# EAGLE design Board (EAGLE 6.5.0)
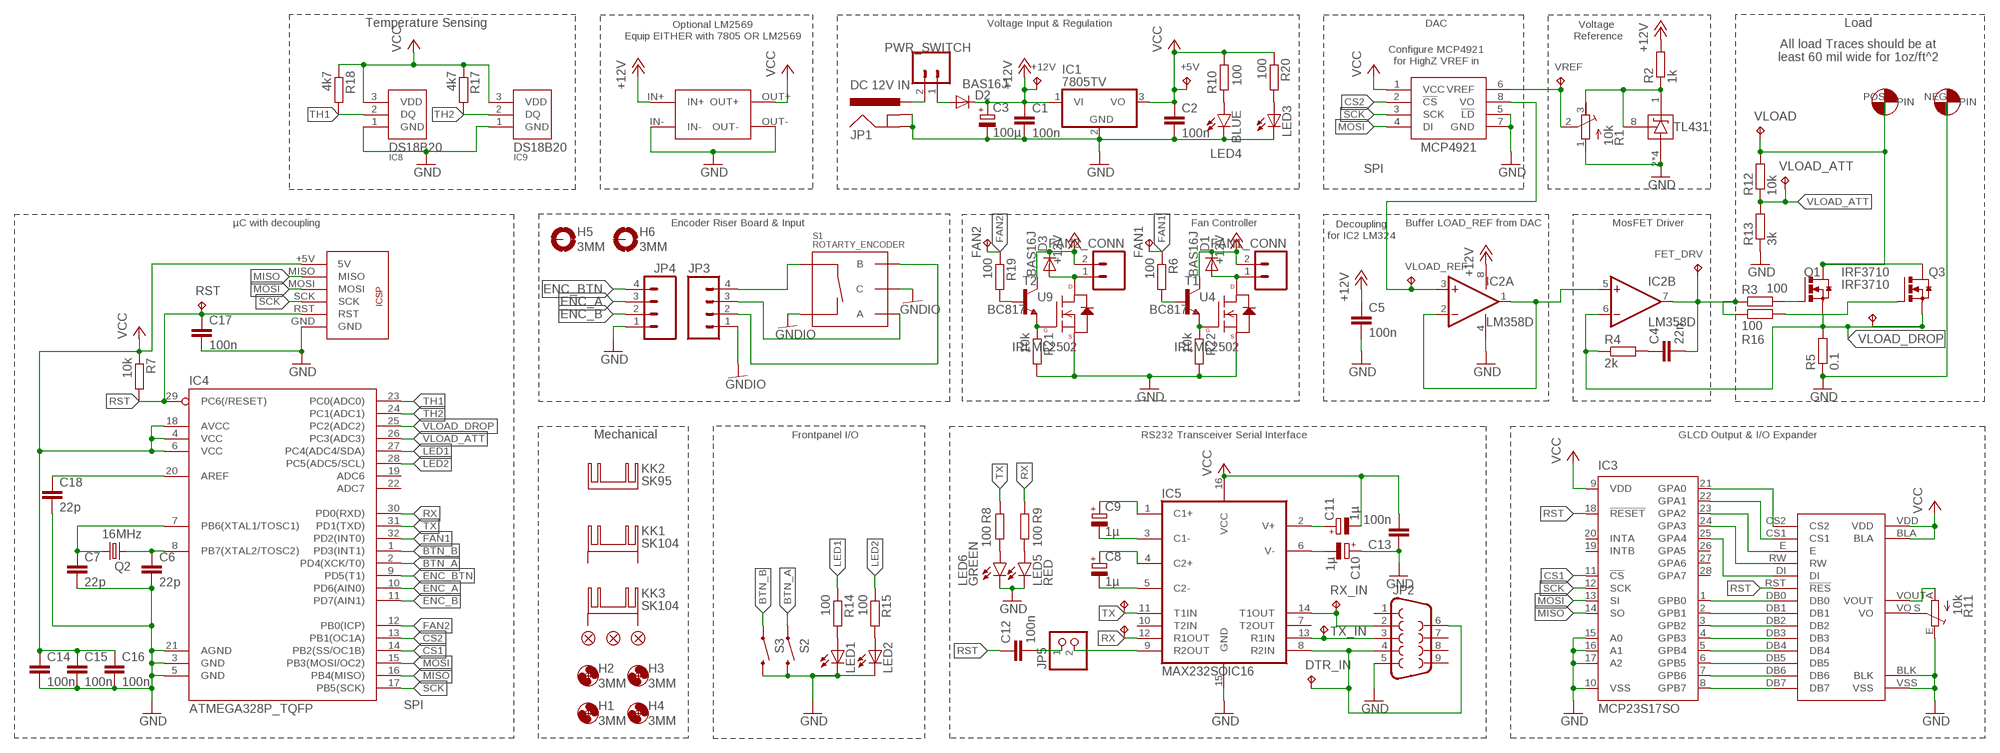
[diagram p0: schematic, sheet 1]

## Parts
+5V  TPB1,27  [B1,27]
+12V  TPB1,27  [B1,27]
C1  100n  C-EUC1206K  [C1206K]
C2  100n  C-EUC1206K  [C1206K]
C3  100µ  CPOL-EU175TMP-0808  [175TMP-0808]
C4  22n  C-EUC1206  [C1206]
C5  100n  C-EUC1206K  [C1206K]
C6  22p  C-EUC1206K  [C1206K]
C7  22p  C-EUC1206K  [C1206K]
C8  1µ  CPOL-EU153CLV-0405  [153CLV-0405]
C9  1µ  CPOL-EU153CLV-0405  [153CLV-0405]
C10  1µ  CPOL-EU153CLV-0405  [153CLV-0405]
C11  1µ  CPOL-EU153CLV-0405  [153CLV-0405]
C12  100n  C-EUC1206K  [C1206K]
C13  100n  C-EUC1206K  [C1206K]
C14  100n  C-EUC1206K  [C1206K]
C15  100n  C-EUC1206K  [C1206K]
C16  100n  C-EUC1206K  [C1206K]
C17  100n  C-EUC1206K  [C1206K]
C18  22p  C-EUC1206K  [C1206K]
D1  BAS16J  DIODE-SOD323-W  [SOD323-W]
D2  BAS16J  DIODE-SOD323-W  [SOD323-W]
D3  BAS16J  DIODE-SOD323-W  [SOD323-W]
DTR_IN  TPB1,27  [B1,27]
FAN1  TPB1,27  [B1,27]
FAN1_CONN  M02POLAR  [MOLEX-1X2]
FAN2  TPB1,27  [B1,27]
FAN2_CONN  M02POLAR  [MOLEX-1X2]
FET_DRV  TPB1,27  [B1,27]
FID1  FIDUCIAL1X2  [FIDUCIAL-1X2]
FID2  FIDUCIAL1X2  [FIDUCIAL-1X2]
FID3  FIDUCIAL1X2  [FIDUCIAL-1X2]
H1  3MM  MOUNT-HOLE3.0  [3,0]
H2  3MM  MOUNT-HOLE3.0  [3,0]
H3  3MM  MOUNT-HOLE3.0  [3,0]
H4  3MM  MOUNT-HOLE3.0  [3,0]
H5  3MM  MOUNT-PAD-ROUND3.0  [3,0-PAD]
H6  3MM  MOUNT-PAD-ROUND3.0  [3,0-PAD]
IC1  7805TV  [TO220V]
IC2  LM358D  [SO08]
IC3  MCP23S17SO  [SO28W]
IC4  ATMEGA328P_TQFP  [TQFP32-08]
IC5  MAX232SOIC16  [SO016]
IC6  MCP4921  [SO-8]
IC7  TL431CD  [SO-8]
IC8  DS18B20  [TO-92]
IC9  DS18B20  [TO-92]
JP1  DC 12V IN  POWER_JACKPTH  [POWER_JACK_PTH]
JP2  DB9FEMALE  [DB9]
JP3  M04POLAR  [MOLEX-1X4]
JP4  M04POLAR  [MOLEX-1X4]
JP5  PINHD-1X2  [1X02]
KK1  SK104  SK104-PAD  [SK104-PAD]
KK2  SK95  SK95-2M3  [SK95-2M3]
KK3  SK104  SK104-PAD  [SK104-PAD]
LED1  LEDB155  [Q62902-B155]
LED2  LEDB155  [Q62902-B155]
LED3  LEDB155  [Q62902-B155]
LED4  BLUE  LED0603  [LED-0603]
LED5  RED  LED0603  [LED-0603]
LED6  GREEN  LED0603  [LED-0603]
PWR_SWITCH  M02POLAR  [MOLEX-1X2]
Q1  IRF3710  IRFZ44N  [TO-220-V]
Q2  16MHz  CRYSTALHC49UP  [HC49UP]
Q3  IRF3710  IRFZ44N  [TO-220-V]
R1  10k  R-TRIMM3296Y  [RTRIM3296Y]
R2  1k  R-EU_M1206  [M1206]
R3  100  R-EU_R1206  [R1206]
R4  2k  R-EU_R1206  [R1206]
R5  0.1  R-EU_VTA52  [VTA52]
R6  100  R-EU_R1206  [R1206]
R7  10k  R-EU_R1206  [R1206]
R8  100  R-EU_R1206  [R1206]
R9  100  R-EU_R1206  [R1206]
R10  100  R-EU_R1206  [R1206]
R11  10k  TRIM_EU-RS3  [RS3]
R12  10k  R-EU_R1206  [R1206]
R13  3k  R-EU_R1206  [R1206]
R14  100  R-EU_R1206  [R1206]
R15  100  R-EU_R1206  [R1206]
R16  100  R-EU_R1206  [R1206]
R17  4k7  R-EU_M1206  [M1206]
R18  4k7  R-EU_M1206  [M1206]
R19  100  R-EU_R1206  [R1206]
R20  100  R-EU_R1206  [R1206]
R21  10k  R-EU_R1206  [R1206]
R22  10k  R-EU_R1206  [R1206]
RST  TPB1,27  [B1,27]
RX  TPB1,27  [B1,27]
RX_IN  TPB1,27  [B1,27]
S1  ROTARTY_ENCODER  [ROTARY_ENC_PLAIN]
S2  SWITCH-MOMENTARY-2SIDE_EZ  [TACTILE-PTH-SIDEEZ]
S3  SWITCH-MOMENTARY-2SIDE_EZ  [TACTILE-PTH-SIDEEZ]
T1  BC817  BC817-NPN-SOT23-BEC  [SOT23-BEC]
T2  BC817  BC817-NPN-SOT23-BEC  [SOT23-BEC]
TX  TPB1,27  [B1,27]
TX_IN  TPB1,27  [B1,27]
U4  IRLML2502  N-CHANNEL-MOSFET-BSS138  [SOT23-3]
U9  IRLML2502  N-CHANNEL-MOSFET-BSS138  [SOT23-3]
U$3  CON-2-HIGAMP  [CON-HIGHAMP-0.3"]
U$5  ICSPTHROUGHHOLE  [ICSP-THROUGHHOLE]
U$6  KS0108-GLCDS6B0108  [KS0108-S6B0108-GLCD]
U$10  LM2569NO_OUTLINE  [LM2596_NO_OUTLINE]
VLOAD  TPB1,27  [B1,27]
VLOAD_ATT  TPB1,27  [B1,27]
VLOAD_DROP  TPB1,27  [B1,27]
VLOAD_REF  TPB1,27  [B1,27]
VREF  TPB1,27  [B1,27]

## Nets
+12V: +12V.TP C1.1 C3.+ C5.1 D1.C D2.C D3.C FAN1_CONN.2 FAN2_CONN.2 IC1.1(VI) IC2.8(P:V+) R2.2 T1.C T2.C U$10.IN+
BTN_A: IC4.2(PD4(XCK/T0)) S2.1
BTN_B: IC4.1(PD3(INT1)) S3.1
CS1: IC3.11(!CS) IC4.14(PB2(SS/OC1B))
CS2: IC4.13(PB1(OC1A)) IC6.2(!CS!)
ENC_A: IC4.10(PD6(AIN0)) JP4.3
ENC_B: IC4.11(PD7(AIN1)) JP4.2
ENC_BTN: IC4.9(PD5(T1)) JP4.4
FAN1: FAN1.TP IC4.32(PD2(INT0)) R6.1
FAN2: FAN2.TP IC4.12(PB0(ICP)) R19.1
GND: C1.2 C2.2 C3.- C5.2 C6.2 C7.2 C10.+ C13.1 C14.2 C15.2 C16.2 C17.2 C18.2 IC1.2(GND) IC2.4(P:V-) IC3.10(VSS) IC3.15(A0) IC3.16(A1) IC3.17(A2) IC4.3(GND) IC4.5(GND) IC4.21(AGND) IC5.15(GND) IC6.5(!LD!) IC6.7(GND) IC7.2(ANODE) IC7.3(ANODE) IC7.6(ANODE) IC7.7(ANODE) IC8.1(GND) IC9.1(GND) JP1.GND JP1.GNDBREAK JP2.5 JP4.1 LED1.K(C) LED2.K(C) LED3.K(C) LED4.C LED5.C LED6.C R1.1(A) R5.1 R11.E R13.1 R21.2 R22.2 S2.2 S3.2 U4.2(S) U9.2(S) U$3.NEG U$5.GND U$6.BLK U$6.VSS U$10.IN- U$10.OUT-
GNDIO: JP3.1 S1.C S1.SW-
LED1: IC4.27(PC4(ADC4/SDA)) R14.1
LED2: IC4.28(PC5(ADC5/SCL)) R15.1
LOAD+: Q1.2(D) Q3.2(D) R12.2 U$3.POS VLOAD.TP
MISO: IC3.14(SO) IC4.16(PB4(MISO)) U$5.MISO
MOSI: IC3.13(SI) IC4.15(PB3(MOSI/OC2)) IC6.4(DI) U$5.MOSI
N$1: IC7.1(CATHODE) IC7.8(REF) R1.3(E) R2.1
N$2: IC6.6(VREF) R1.2(S) VREF.TP
N$3: C4.1 R4.2
N$4: R22.1 T1.E U4.1(G)
N$5: D1.A FAN1_CONN.1 U4.3(D)
N$6: Q1.1(G) R3.2
N$7: IC5.9(R2OUT) JP5.2
N$8: R6.2 T1.B
N$9: C7.1 IC4.7(PB6(XTAL1/TOSC1)) Q2.1
N$10: C4.2 FET_DRV.TP IC2.7(B:OUT) R3.1 R16.1
N$11: C6.1 IC4.8(PB7(XTAL2/TOSC2)) Q2.2
N$12: DTR_IN.TP IC5.8(R2IN) JP2.4 JP2.6
N$13: IC5.14(T1OUT) JP2.2 RX_IN.TP
N$14: IC5.13(R1IN) JP2.3 TX_IN.TP
N$15: C9.- IC5.3(C1-)
N$16: C9.+ IC5.1(C1+)
N$17: C8.- IC5.5(C2-)
N$18: C8.+ IC5.4(C2+)
N$19: C11.+ IC5.2(V+)
N$20: LED4.A R10.2
N$21: C10.- IC5.6(V-)
N$22: LED6.A R8.2
N$23: LED5.A R9.2
N$24: R11.S U$6.VO
N$25: R11.A U$6.VOUT
N$26: JP1.PWR PWR_SWITCH.2
N$27: IC3.1(GPB0) U$6.DB0
N$28: IC3.2(GPB1) U$6.DB1
N$29: IC3.3(GPB2) U$6.DB2
N$30: IC3.4(GPB3) U$6.DB3
N$31: IC3.5(GPB4) U$6.DB4
N$32: IC3.6(GPB5) U$6.DB5
N$33: IC3.7(GPB6) U$6.DB6
N$34: IC3.8(GPB7) U$6.DB7
N$35: IC3.21(GPA0) U$6.CS2
N$36: IC3.22(GPA1) U$6.CS1
N$37: IC3.23(GPA2) U$6.E
N$38: IC3.24(GPA3) U$6.RW
N$39: IC3.25(GPA4) U$6.DI
N$40: C18.1 IC4.20(AREF)
N$41: D2.A PWR_SWITCH.1
N$42: R21.1 T2.E U9.1(G)
N$43: LED1.A R14.2
N$44: LED2.A R15.2
N$45: JP3.4 S1.SW+
N$46: JP3.3 S1.A
N$47: Q3.1(G) R16.2
N$48: R19.2 T2.B
N$49: JP3.2 S1.B
N$50: D3.A FAN2_CONN.1 U9.3(D)
N$51: LED3.A R20.2
RST: C12.1 C17.1 IC3.18(!RESET) IC4.29(PC6(/RESET)) R7.2 RST.TP U$5.RST U$6.RST(!RES!)
RST_EN: C12.2 JP5.1
RX: IC4.30(PD0(RXD)) IC5.12(R1OUT) R9.1 RX.TP
SCK: IC3.12(SCK) IC4.17(PB5(SCK)) IC6.3(SCK) U$5.SCK
TH1: IC4.23(PC0(ADC0)) IC8.2(DQ) R18.2
TH2: IC4.24(PC1(ADC1)) IC9.2(DQ) R17.2
TX: IC4.31(PD1(TXD)) IC5.11(T1IN) R8.1 TX.TP
VCC: +5V.TP C2.1 C11.- C13.2 C14.1 C15.1 C16.1 IC1.3(VO) IC3.9(VDD) IC4.4(VCC) IC4.6(VCC) IC4.18(AVCC) IC5.16(VCC) IC6.1(VCC) IC8.3(VDD) IC9.3(VDD) R7.1 R10.1 R17.1 R18.1 R20.1 U$5.+5V(5V) U$6.BLA U$6.VDD U$10.OUT+
VLOAD_ATT: IC4.26(PC3(ADC3)) R12.1 R13.2 VLOAD_ATT.TP
VLOAD_DROP: IC2.6(B:-IN) IC4.25(PC2(ADC2)) Q1.3(S) Q3.3(S) R4.1 R5.2 VLOAD_DROP.TP
VLOAD_REF: IC2.3(A:+IN) IC6.8(VO) VLOAD_REF.TP
VREF_BUF: IC2.1(A:OUT) IC2.2(A:-IN) IC2.5(B:+IN)
Unconnected: H5.B3,0(MOUNT) H6.B3,0(MOUNT) IC3.19(INTB) IC3.20(INTA) IC3.26(GPA5) IC3.27(GPA6) IC3.28(GPA7) IC4.19(ADC6) IC4.22(ADC7) IC5.7(T2OUT) IC5.10(T2IN) JP2.1 JP2.7 JP2.8 JP2.9 KK1.K1(K) KK1.K2(K) KK3.K1(K) KK3.K2(K)

## Notes on the sheet
- Temperature Sensing | Voltage Input & Regulation | DAC | Load
- Optional LM2569
  Equip EITHER with 7805 OR LM2569
- Voltage 
  Reference
- All load Traces should be at 
  least 60 mil wide for 1oz/ft^2
- Configure MCP4921
  for HighZ VREF in
- SPI
- µC with decoupling | Encoder Riser Board & Input | Fan Controller | Buffer LOAD_REF from DAC | MosFET Driver
- Decoupling
  for IC2 LM324
- Mechanical | Frontpanel I/O | RS232 Transceiver Serial Interface | GLCD Output & I/O Expander
- SPI

## Library data of the parts
+5V +12V DTR_IN FAN1 FAN2 FET_DRV RST RX RX_IN TX TX_IN VLOAD VLOAD_ATT VLOAD_DROP VLOAD_REF VREF = testpad:TP: Test pad
C1 C2 C4-C7 C12-C18 = rcl:C-EU: CAPACITOR, European symbol
C3 C8-C11 = rcl:CPOL-EU: POLARIZED CAPACITOR, European symbol
D1-D3 = diode:DIODE-: DIODE
FAN1_CONN FAN2_CONN PWR_SWITCH = SparkFun-Connectors:M02: Standard 2-pin 0.1" header. Use with - straight break away headers ( PRT-00116) - right angle break away headers (PRT-00553) - swiss pins (PRT-00743) - machine pins (PRT-00117) - female headers (PRT-00115) Molex polarized connector foot print use with: PRT-08233 with associated crimp pins and housings. 2.54_SCREWTERM for use with PRT-10571. 3.5mm Screw Terminal footprints for PRT-08084 5mm Screw Terminal footprints for use with PRT-08432
FID1-FID3 = SparkFun-Aesthetics:FIDUCIAL: Fiducial Alignment Points Various fiducial points for machine vision alignment.
H1-H4 = holes:MOUNT-HOLE: MOUNTING HOLE with drill center marker
H5 H6 = holes:MOUNT-PAD-ROUND: MOUNTING PAD, round
IC1 = linear:78*: Positive VOLTAGE REGULATOR Source: http://cache.national.com/ds/LM/LM78L05.pdf http://www.fairchildsemi.com/ds/LM/LM7805.pdf
IC2 = linear:LM358: OP AMP also LM158; LM258; LM2904 Source: http://cache.national.com/ds/LM/LM158.pdf
IC3 = microchip:MCP23S17: http://ww1.microchip.com/downloads/en/DeviceDoc/21952a.pdf Source: http://ww1.microchip.com/downloads/en/DeviceDoc/21952a.pdf; MF: MICROCHIP; MPN: MCP23S17-E/SO; OC_FARNELL: unknown; OC_NEWARK: 31K2950
IC4 = SparkFun-DigitalIC:ATMEGA328P_TQFP; PROD_ID: IC-09069
IC5 = SparkFun-DigitalIC:MAX232: RS232 Transceiver Very common IC. This is generically called 'MAX232', but works with the 3V equivalent MAX3232 generic ICs. Field tested and mother approved. Spark Fun Electronics SKU : COM-00316 (DIP) and COM-00589 (SMD); PROD_ID: IC-08171
IC6 = OwnStuff:MCP4921
IC7 = OwnStuff:TL431
IC8 IC9 = OwnStuff:DS18B20
JP1 = SparkFun-Connectors:POWER_JACK: Power Jack This is the standard 5.5mm barrel jack for power. The PTH is the most common, proven, reliable, footprint. The Slot footprint only works if the mill layer is transmitted to the PCB fab house so be warned. Mating wall wart : TOL-00298 (and others); PROD_ID: CONN-08197
JP2 = SparkFun-Connectors:DB9: DB9 Connector Standard DB9 (D-Sub 9) serial connector. Can be used for CAN bus as well as RS485 and RS232. Footprint production proven. Spark Fun Electronics SKU : PRT-00429; PROD_ID: CONN-08194
JP3 JP4 = SparkFun-Connectors:M04: Header 4 Standard 4-pin 0.1" header. Use with straight break away headers (SKU : PRT-00116), right angle break away headers (PRT-00553), swiss pins (PRT-00743), machine pins (PRT-00117), and female headers (PRT-00115). Molex polarized connector foot print use with SKU : PRT-08231 with associated crimp pins and housings. 1MM SMD Version SKU: PRT-10208
JP5 = pinhead:PINHD-1X2: PIN HEADER
KK1 KK3 = heatsink:SK104-PAD: HEATSINK manufacturer Fischer/distributor Buerklin
KK2 = heatsink:SK95-2M3: HEATSINK manufacturer Fischer/distributor Buerklin
LED1-LED3 = led:LED: LED OSRAM: - CHIPLED LG R971, LG N971, LY N971, LG Q971, LY Q971, LO R971, LY R971 LH N974, LH R974 LS Q976, LO Q976, LY Q976 LO Q996 - Hyper CHIPLED LW Q18S LB Q993, LB Q99A, LB R99A - SideLED LS A670, LO A670, LY A670, LG A670, LP A670 LB A673, LV A673, LT A673, LW A673 LH A674 LY A675 LS A676, LA A676, LO A676, LY A676, LW A676 LS A679, LY A679, LG A679 - Hyper Micro SIDELED® LS Y876, LA Y876, LO Y876, LY Y876 LT Y87S - SmartLED LW L88C, LW L88S LB L89C, LB L89S, LG L890 LS L89K, LO L89K, LY L89K LS L896, LA L896, LO L896, LY L896 - TOPLED LS T670, LO T670, LY T670, LG T670, LP T670 LSG T670, LSP T670, LSY T670, LOP T670, LYG T670 LG T671, LOG T671, LSG T671 LB T673, LV T673, LT T673, LW T673 LH T674 LS T676, LA T676, LO T676, LY T676, LB T676, LH T676, LSB T676, LW T676 LB T67C, LV T67C, LT T67C, LS T67K, LO T67K, LY T67K, LW E67C LS E67B, LA E67B, LO E67B, LY E67B, LB E67C, LV E67C, LT E67C LW T67C LS T679, LY T679, LG T679 LS T770, LO T770, LY T770, LG T770, LP T770 LB T773, LV T773, LT T773, LW T773 LH T774 LS E675, LA E675, LY E675, LS T675 LS T776, LA T776, LO T776, LY T776, LB T776 LHGB T686 LT T68C, LB T68C - Hyper Mini TOPLED® LB M676 - Mini TOPLED Santana® LG M470 LS M47K, LO M47K, LY M47K Source: http://www.osram.convergy.de LUXEON: - LUMILED® LXK2-PW12-R00, LXK2-PW12-S00, LXK2-PW14-U00, LXK2-PW14-V00 LXK2-PM12-R00, LXK2-PM12-S00, LXK2-PM14-U00 LXK2-PE12-Q00, LXK2-PE12-R00, LXK2-PE12-S00, LXK2-PE14-T00, LXK2-PE14-U00 LXK2-PB12-K00, LXK2-PB12-L00, LXK2-PB12-M00, LXK2-PB14-N00, LXK2-PB14-P00, LXK2-PB14-Q00 LXK2-PR12-L00, LXK2-PR12-M00, LXK2-PR14-Q00, LXK2-PR14-R00 LXK2-PD12-Q00, LXK2-PD12-R00, LXK2-PD12-S00 LXK2-PH12-R00, LXK2-PH12-S00 LXK2-PL12-P00, LXK2-PL12-Q00, LXK2-PL12-R00 Source: www.luxeon.com KINGBRIGHT: KA-3528ASYC Source: www.kingbright.com
LED4-LED6 = SparkFun-LED:LED: LEDs Standard schematic elements and footprints for 5mm, 3mm, 1206, and 0603 sized LEDs. 5mm - Spark Fun Electronics SKU : COM-00529 (and others)
Q1 Q3 = OwnStuff:IRFZ44N
Q2 = crystal:CRYSTAL: CRYSTAL; OC_FARNELL: unknown; OC_NEWARK: unknown
R1 = rcl:R-TRIMM: Trimm resistor
R2-R10 R12-R22 = rcl:R-EU_: RESISTOR, European symbol
R11 = pot:TRIM_EU-: POTENTIOMETER
S1 = SparkFun-Electromechanical:ROTARTY_ENCODER: Simple no LED rotary encoder Example: COM-09117
S2 S3 = SparkFun-Electromechanical:SWITCH-MOMENTARY-2: Various NO switches- pushbuttons, reed, etc
T1 T2 = transistor:*-NPN-: NPN Transistror BF959 corrected 2008.03.06
U4 U9 = GeekAmmo:N-CHANNEL-MOSFET: N-Channel MOSFET Mode Field Effect Transistor; DATASHEET: http://www.fairchildsemi.com/ds/BS/BSS138.pdf; DIGIKEY: BSS138TR-ND; ELEMENT14: 2323154; URL: http://au.element14.com/fairchild-semiconductor/bss138/mosfet-n-ch-50v-220ma-sot-23/dp/2323154
U$3 = OwnStuff:CON-2-HIGAMP
U$5 = OwnStuff:ICSP
U$6 = OwnStuff:KS0108-GLCD
U$10 = OwnStuff:LM2569

## Board
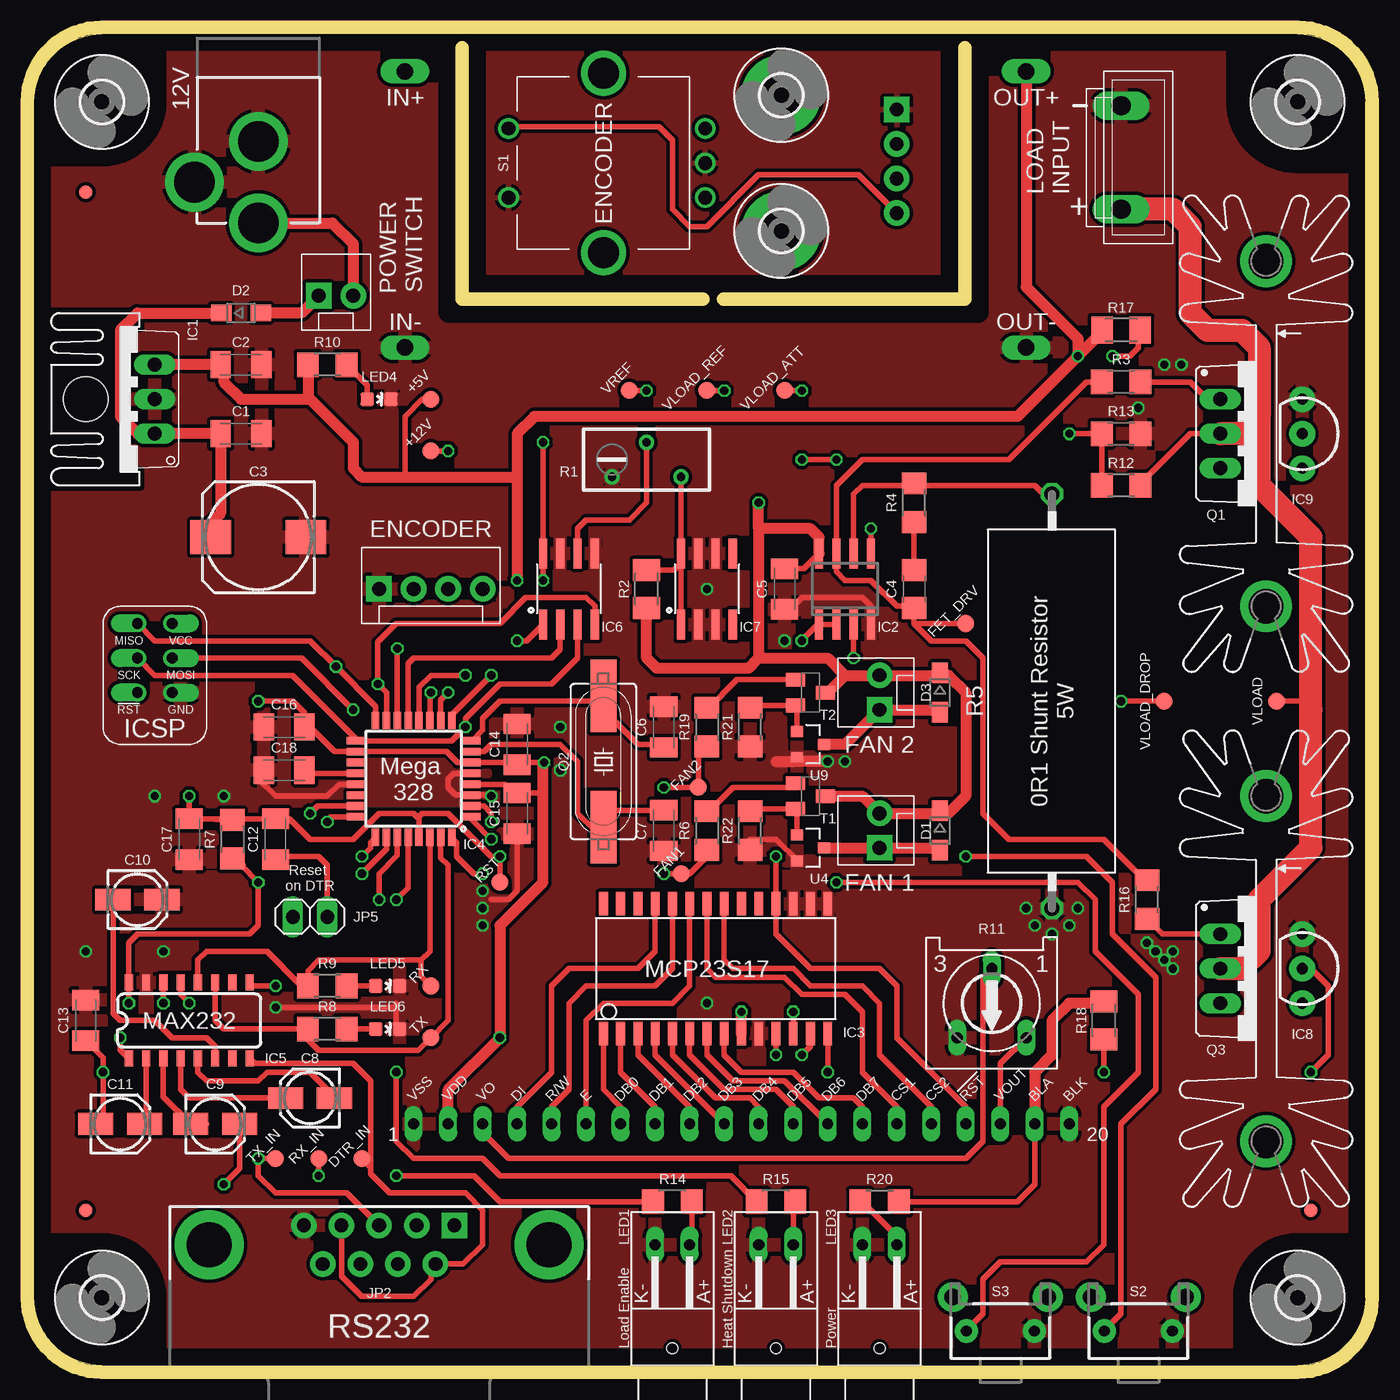
[diagram p1: board, top side]
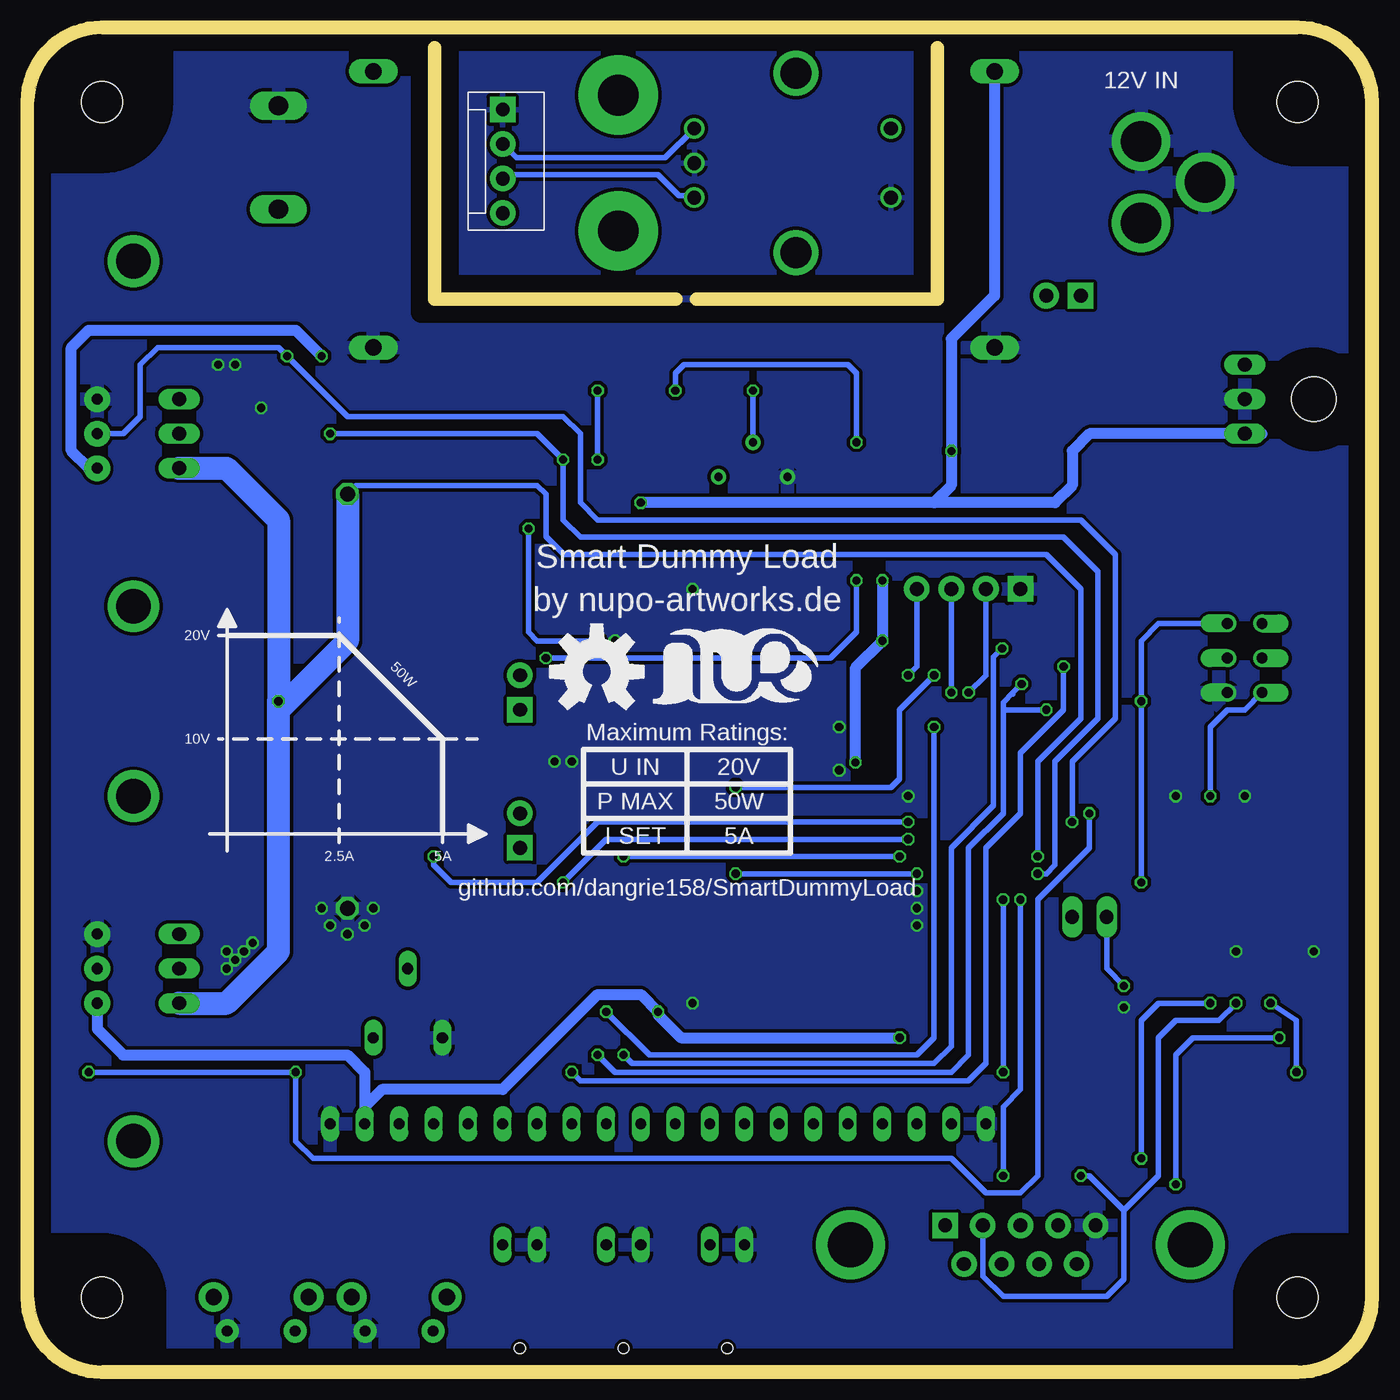
[diagram p2: board, bottom side, seen from below]

Size 98 x 98 mm. Coordinates in mm from the lower left corner, seen from the top.
Outline: 5,0 93,0 arc90 98,5 98,93 arc90 93,98 5,98 arc90 0,93 0,5 arc90 5,0
Copper layers (1*16): Top 0.035mm / dielectric 1.5mm / Bottom 0.035mm
Design rules "dirt_cheap_dirty_boards.v1 *": minimum track width 5mil, minimum drill 12mil, track to track 5mil, track to pad 5mil, pad to pad 5mil, via to via 5mil, smd to smd 0mil, copper to edge 10mil, drill to drill 10mil, minimum pad ring 10mil, minimum via ring 6mil, stop-mask expansion 2mil, vias tented up to drill 25mil, thermal gap 10mil
tRestrict: area 0.5,0.5 to 9,9; area 0.5,89 to 9,97.5; area 88.5,88.5 to 97.5,97.5; area 89,0.5 to 97.5,9; 16 lines
bRestrict: area 0.5,89 to 9,97.5; area 88.5,88.5 to 97.5,97.5; area 89,0.5 to 97.5,9; area 0.5,0.5 to 9,9; 16 lines
Milling: 12 lines

### Footprints (pad centres in the part's own frame; a part is rotated, then mirrored left to right if it is on the bottom)
B1,27 = smd 1.27 x 1.27: TP 0,0
C1206K = smd 1.5 x 2: 1 -1.5,0; 2 1.5,0
175TMP-0808 = smd 3 x 2.5: + 3.5,0; - -3.5,0
C1206 = smd 1.6 x 1.8: 1 -1.4,0; 2 1.4,0
153CLV-0405 = smd 2.6 x 1.6: + 1.8,0; - -1.8,0
SOD323-W = smd 1.5 x 1.2: A 1.45,0; C -1.45,0
MOLEX-1X2 = drill 1.016 pad 1.88 square: 1 0,0 | drill 1.016 pad 1.88: 2 2.54,0
FIDUCIAL-1X2 = smd 1 x 1: 1 0,0
3,0 = hole 3: 0,0
3,0-PAD = drill 3 pad 5.842: B3,0 0,0
TO220V = drill 1.016 long: 1 -2.54,-2.54; 2 0,-2.54; 3 2.54,-2.54
SO08 = smd 0.6 x 2.2: 1 -1.905,-2.6; 2 -0.635,-2.6; 3 0.635,-2.6; 4 1.905,-2.6; 5 1.905,2.6; 6 0.635,2.6; 7 -0.635,2.6; 8 -1.905,2.6
SO28W = smd 0.65 x 1.7: 1 -7.62,-4.78; 2 -6.35,-4.78; 3 -5.08,-4.78; 4 -3.81,-4.78; 5 -2.54,-4.78; 6 -1.27,-4.78; 7 0,-4.78; 8 1.27,-4.78; 9 2.54,-4.78; 10 3.81,-4.78; 11 5.08,-4.78; 12 6.35,-4.78; 13 7.62,-4.78; 14 8.89,-4.78; 15 8.89,4.78; 16 7.62,4.78; 17 6.35,4.78; 18 5.08,4.78; 19 3.81,4.78; 20 2.54,4.78; 21 1.27,4.78; 22 0,4.78; 23 -1.27,4.78; 24 -2.54,4.78; 25 -3.81,4.78; 26 -5.08,4.78; 27 -6.35,4.78; 28 -7.62,4.78
TQFP32-08 = smd 1.27 x 0.559: 1 -4.293,2.8; 2 -4.293,2; 3 -4.293,1.2; 4 -4.293,0.4; 5 -4.293,-0.4; 6 -4.293,-1.2; 7 -4.293,-2; 8 -4.293,-2.8; 17 4.293,-2.8; 18 4.293,-2; 19 4.293,-1.2; 20 4.293,-0.4; 21 4.293,0.4; 22 4.293,1.2; 23 4.293,2; 24 4.293,2.8 | smd 0.559 x 1.27: 9 -2.8,-4.293; 10 -2,-4.293; 11 -1.2,-4.293; 12 -0.4,-4.293; 13 0.4,-4.293; 14 1.2,-4.293; 15 2,-4.293; 16 2.8,-4.293; 25 2.8,4.293; 26 2,4.293; 27 1.2,4.293; 28 0.4,4.293; 29 -0.4,4.293; 30 -1.2,4.293; 31 -2,4.293; 32 -2.8,4.293
SO016 = smd 0.6 x 1.2: 1 -4.445,-2.8; 2 -3.175,-2.8; 3 -1.905,-2.8; 4 -0.635,-2.8; 5 0.635,-2.8; 6 1.905,-2.8; 7 3.175,-2.8; 8 4.445,-2.8; 9 4.445,2.8; 10 3.175,2.8; 11 1.905,2.8; 12 0.635,2.8; 13 -0.635,2.8; 14 -1.905,2.8; 15 -3.175,2.8; 16 -4.445,2.8
SO-8 = smd 0.61 x 2.21: 1 -1.905,-2.616; 2 -0.635,-2.616; 3 0.635,-2.616; 4 1.905,-2.616; 5 1.905,2.616; 6 0.635,2.616; 7 -0.635,2.616; 8 -1.905,2.616
TO-92 = drill 0.813 pad 1.88: 1 -2.54,0; 2 0,0; 3 2.54,0
POWER_JACK_PTH = drill 2.997 pad 4.318: GND 0,7.7; GNDBREAK 4.7,10.7; PWR 0,13.7
DB9 = drill 1.016 pad 1.88 square: 1 -5.54,-1.42 | drill 1.016 pad 1.88: 2 -2.77,-1.42; 3 0,-1.42; 4 2.77,-1.42; 5 5.54,-1.42; 6 -4.15,1.42; 7 -1.38,1.42; 8 1.38,1.42; 9 4.15,1.42 | drill 3.302 pad 5.08: G1 -12.5,0; G2 12.5,0
MOLEX-1X4 = drill 1.016 pad 1.88 square: 1 0,0 | drill 1.016 pad 1.88: 2 2.54,0; 3 5.08,0; 4 7.62,0
1X02 = drill 1.016 long: 1 -1.27,0; 2 1.27,0
SK104-PAD = drill 2.54 pad 3.81: K1 -12.7,-0.762; K2 12.7,-0.762
SK95-2M3 = hole 3.302: 0,2.54
Q62902-B155 = drill 0.813 long: A 7.62,-1.27; K 7.62,1.27 | hole 0.813: 0,0
LED-0603 = smd 1 x 1: A 0,-0.877; C 0,0.877
TO-220-V = drill 1.016 long: 1 -2.54,0; 2 0,0; 3 2.54,0
HC49UP = smd 5.334 x 1.93: 1 -4.826,0; 2 4.826,0
RTRIM3296Y = drill 0.61: 1 1.27,-2.54; 2 -1.27,0; 3 1.27,2.54
M1206 = smd 1.6 x 2: 1 -1.4,0; 2 1.4,0
R1206 = smd 1.6 x 1.803: 1 -1.422,0; 2 1.422,0
VTA52 = drill 1.1 octagon: 1 -15.24,0; 2 15.24,0
RS3 = drill 0.813 long: A -2.54,2.54; E 2.54,2.54; S 0,-2.54
ROTARY_ENC_PLAIN = drill 1.016: A 7.493,-2.54; B 7.493,2.54; C 7.493,0; SW+ -6.985,2.54; SW- -6.985,-2.54 | drill 2.286: P$3 0,6.604; P$4 0,-6.604
TACTILE-PTH-SIDEEZ = drill 0.8 pad 1.7: 1 -2.5,0; 2 2.5,0 | drill 1.2 pad 2.2: ANCHOR1 -3.5,2.5; ANCHOR2 3.5,2.5
SOT23-BEC = smd 1 x 1.4: B -0.95,-1.1; C 0,1.1; E 0.95,-1.1
SOT23-3 = smd 0.8 x 0.9: 1 -0.95,-1; 2 0.95,-1; 3 0,1
CON-HIGHAMP-0.3" = drill 1.4 long: NEG 3.81,0; POS -3.81,0
ICSP-THROUGHHOLE = drill 0.8 offset: +5V 1.27,2.54; GND 1.27,-2.54; MISO -1.27,2.54; MOSI 1.27,0; RST -1.27,-2.54; SCK -1.27,0
KS0108-S6B0108-GLCD = drill 0.8 long: BLA 21.59,0; BLK 24.13,0; CS1 11.43,0; CS2 13.97,0; DB0 -8.89,0; DB1 -6.35,0; DB2 -3.81,0; DB3 -1.27,0; DB4 1.27,0; DB5 3.81,0; DB6 6.35,0; DB7 8.89,0; DI -16.51,0; E -11.43,0; RST 16.51,0; RW -13.97,0; VDD -21.59,0; VO -19.05,0; VOUT 19.05,0; VSS -24.13,0
LM2596_NO_OUTLINE = drill 1.2 long: IN+ -22.86,10.16; IN- -22.86,-10.16; OUT+ 22.86,10.16; OUT- 22.86,-10.16

### Placement (x,y rotation side)
+5V  29.21,71.12 0 top
+12V  29.21,67.31 0 top
C1  15.24,68.58 0 top
C2  15.24,73.66 0 top
C3  16.51,60.96 180 top
C4  64.77,57.15 270 top
C5  55.24,57.15 270 top
C6  46.35,46.99 90 top
C7  46.35,39.37 270 top
C8  20.32,19.68 180 top
C9  13.34,17.78 0 top
C10  7.62,34.29 0 top
C11  6.35,17.78 0 top
C12  17.78,38.73 270 top
C13  3.81,25.4 270 top
C14  35.56,45.72 90 top
C15  35.56,40.64 270 top
C16  18.41,46.99 180 top
C17  11.43,38.73 270 top
C18  18.41,43.81 180 top
D1  66.67,39.37 270 top
D2  15.24,77.47 0 top
D3  66.67,49.53 270 top
DTR_IN  24.13,15.24 0 top
FAN1  47.62,36.2 0 top
FAN1_CONN  62.23,38.1 90 top
FAN2  48.9,42.55 0 top
FAN2_CONN  62.23,48.26 90 top
FET_DRV  68.58,54.61 90 top
FID1  3.81,11.43 0 top
FID2  3.81,86.36 0 top
FID3  93.98,11.43 0 top
H1  93,93 0 top
H2  5,5 0 top
H3  93,5 0 top
H4  5,93 0 top
H5  55,93.5 0 top
H6  55,83.5 0 top
IC1  6.35,71.12 90 top
IC2  59.69,57.15 0 top
IC3  49.53,29.21 0 top
IC4  27.94,43.18 180 top
IC5  11.43,25.4 0 top
IC6  39.37,57.15 0 top
IC7  49.53,57.15 0 top
IC8  93.34,29.21 270 top
IC9  93.34,68.58 270 top
JP1  16.51,97.79 180 top
JP2  25.4,8.89 180 top
JP3  63.5,92.44 270 bottom
JP4  25.4,57.15 0 top
JP5  20.32,33.02 180 top
KK1  91.44,68.58 270 top
KK2  6.35,71.12 90 top
KK3  91.44,29.21 270 top
LED1  46.99,1.27 90 top
LED2  54.61,1.27 90 top
LED3  62.23,1.27 90 top
LED4  25.4,71.12 270 top
LED5  26.04,27.94 270 top
LED6  26.04,24.77 270 top
PWR_SWITCH  20.95,78.74 0 top
Q1  87.31,68.58 270 top
Q2  41.91,44.45 90 top
Q3  87.31,29.21 270 top
R1  45.09,66.67 270 top
R2  45.09,57.15 270 top
R3  80.01,72.39 0 top
R4  64.77,63.5 270 top
R5  74.93,48.9 90 top
R6  49.53,39.37 90 top
R7  14.61,38.73 90 top
R8  21.59,24.77 0 top
R9  21.59,27.94 0 top
R10  21.59,73.66 0 top
R11  70.48,26.67 180 top
R12  80.01,64.77 0 top
R13  80.01,68.58 180 top
R14  46.99,12.06 0 top
R15  54.61,12.06 0 top
R16  81.92,34.29 270 top
R17  80.01,76.2 0 top
R18  78.74,25.4 270 top
R19  49.53,46.99 90 top
R20  62.23,12.06 180 top
R21  52.7,46.99 270 top
R22  52.7,39.37 270 top
RST  34.29,35.56 0 top
RX  29.21,27.94 0 top
RX_IN  20.95,15.24 0 top
S1  41.91,88.5 0 top
S2  81.28,2.54 0 top
S3  71.12,2.54 0 top
T1  57.15,41.91 270 top
T2  57.15,49.53 270 top
TX  29.21,24.13 0 top
TX_IN  17.78,15.24 0 top
U4  57.15,38.1 270 top
U9  57.15,45.72 270 top
U$1  [LOGO-SILKSCREEN]  46.51,50.44 0 bottom
U$2  [OSHW-LOGO-L]  56.58,51.07 0 bottom
U$3  80.01,88.9 90 top
U$5  8.89,52.07 0 top
U$6  52.07,17.78 0 top
U$10  50.16,85.09 0 top
VLOAD  91.44,48.9 90 top
VLOAD_ATT  55.24,71.75 0 top
VLOAD_DROP  83.19,48.9 90 top
VLOAD_REF  49.53,71.75 0 top
VREF  43.81,71.75 0 top

### Tracks (layer width: path | path; a pad name or v marks a point on that pad's centre or on a via)
+12V  (via drill 0.6)
  Top 0.406: C5.1 56.69,58.65 IC2.8 | +12V.TP v30.48,67.31
  Top 0.813: 53.34,61.59 v53.34,63.5 | IC2.8 57.78,60.96 57.15,61.59 53.34,61.59 | 53.34,61.59 53.34,52.07 | 66.22,40.64 FAN1_CONN.2 60.96,41.91 T1.C | 66.5,50.8 D3.C | 59.69,50.8 FAN2_CONN.2 66.5,50.8 | 53.34,52.07 58.42,52.07 59.69,50.8 | 53.34,52.07 52.58,51.3 45.85,51.3 45.09,52.07 R2.2 | T2.C 58.42,49.53 59.69,50.8 | 66.5,50.8 67.31,50.8 68.58,49.53 68.58,41.91 67.31,40.64 66.5,40.64 66.22,40.64 | 66.22,40.64 D1.C | D2.C 7.62,77.47 6.35,76.2 6.35,69.85 7.62,68.58 IC1.1 C1.1 13.74,62.71 13.01,61.98 C3.+
  Top 0.838: 66.5,40.64 D1.C
  Bottom 0.813: 31.75,63.5 22.86,63.5 21.59,64.77 21.59,67.31 20.32,68.58 IC1.1 7.62,68.58 | 31.75,63.5 v53.34,63.5 | U$10.IN+ 27.3,78.74 30.48,75.56 v30.48,67.31 30.48,64.77 31.75,63.5
BTN_A  (via drill 0.6)
  Top 0.406: S2.1 78.78,2.58 80.01,3.81 80.01,17.78 82.55,20.32 82.55,28.57 79.38,31.75 79.38,35.56 77.47,37.47 v68.58,37.47 | IC4.2 33.12,41.18 33.66,40.64 v33.66,40.01
  Bottom 0.406: v33.66,40.01 56.52,40.01 60.96,35.56 67.31,35.56 68.58,36.83 v68.58,37.47
BTN_B  (via drill 0.6)
  Top 0.406: S3.1 68.62,2.58 69.85,3.81 69.85,6.35 71.12,7.62 77.47,7.62 78.74,8.89 78.74,19.05 81.28,21.59 81.28,27.3 78.11,30.48 78.11,34.29 76.83,35.56 v59.05,35.56 | v33.66,38.73 32.23,40.16 IC4.1
  Bottom 0.406: v59.05,35.56 55.88,38.73 v33.66,38.73
CS1  (via drill 0.6)
  Top 0.406: IC4.14 v26.74,52.77 | v54.61,22.86 IC3.11
  Bottom 0.406: v54.61,22.86 53.98,22.23 31.75,22.23 30.48,23.5 30.48,38.1 27.38,41.2 27.38,52.14 v26.74,52.77
CS2
  Top 0.406: IC6.2 38.73,52.7 38.1,52.07 27.94,52.07 27.54,51.67 IC4.13
ENC_A  (via drill 0.6)
  Top 0.406: IC4.10 29.94,48.99 v30.48,49.53
  Bottom 0.406: JP4.3 v30.48,49.53
ENC_B  (via drill 0.6)
  Top 0.406: IC4.11 29.14,49.6 v29.21,49.53
  Bottom 0.406: JP4.2 27.94,50.8 v29.21,49.53
ENC_BTN  (via drill 0.6)
  Top 0.406: IC4.9 30.74,47.88 v33.66,50.8
  Bottom 0.406: JP4.4 33.02,51.44 v33.66,50.8
FAN1  (via drill 0.6)
  Top 0.406: v33.02,36.2 32.38,36.2 31.11,37.47 31.11,38.51 IC4.32 | v46.35,36.2 FAN1.TP 48.26,36.2 49.53,37.47 R6.1
  Bottom 0.406: v46.35,36.2 v33.02,36.2
FAN2  (via drill 0.6)
  Top 0.406: IC4.12 28.34,49.93 29.21,50.8 v31.75,50.8 | v46.35,42.55 FAN2.TP 48.9,45.09 49.53,45.72 50.01,45.72 R19.1
  Bottom 0.406: v31.75,50.8 34.29,48.26 34.29,43.18 34.92,42.55 v46.35,42.55
GND  (via drill 0.6)
  Top 0.406: IC2.4 61.59,55.88 60.96,56.52 56.52,56.52 55.88,55.88 54.84,55.88 C5.2 | IC4.21 22.46,42.78 21.59,41.91 17.78,41.91 16.51,43.18 16.51,43.41 C18.2 | IC4.5 30.88,43.58 30.48,43.18 30.48,42.55 31.05,41.98 IC4.3 33.59,41.98 v33.66,41.91 | C15.2 35.56,34.92 34.92,34.29 33.66,34.29 | LED6.C 26.67,25.01 26.67,26.35 | 26.67,26.67 26.67,26.35 | 26.67,26.35 v17.78,26.35 | U4.2 56.15,37.2 54.61,38.73 52.7,38.73 R22.2
  Top 0.813: v58.42,44.45 55.83,44.45 | 54.61,44.45 55.83,44.45 | 55.83,44.45 U9.2
  other vias: 81.28,70.48 49.53,26.67 3.81,30.48 9.53,30.48 49.53,57.15 55.24,53.34 73.03,33.66 73.66,32.38 74.93,31.75 76.2,32.38 76.83,33.66 38.73,43.81 38.73,46.99 59.69,44.45 33.02,34.92 8.89,41.91 13.97,41.91 83.19,73.66 84.45,73.66 82.55,30.48 81.92,31.11 83.19,29.84 83.82,29.21 83.82,30.48 33.02,33.66 33.02,32.38
  pour Bottom (isolate 0.254): -0.5,93 arc-90 5,98.5 30.5,98.5 30.5,77.5 69.5,77.5 69.5,98.5 93,98.5 arc-90 98.5,93 98.5,5 arc-90 93,-0.5 5,-0.5 arc-90 -0.5,5
  pour Top (isolate 0.254): -0.5,93 arc-90 5,98.5 30.5,98.5 30.5,77.5 69.5,77.5 69.5,98.5 93,98.5 arc-90 98.5,93 98.5,5 arc-90 93,-0.5 5,-0.5 arc-90 -0.5,5
GNDIO
  pour Bottom (isolate 0.254): 31.73,98.5 31.73,78.46 68.27,78.46 68.27,98.5
  pour Top (isolate 0.254): 31.5,98.5 31.5,78.5 68.5,78.5 68.5,98.5
LED1  (via drill 0.6)
  Top 0.406: R14.1 34.29,12.06 32.38,13.97 v26.67,13.97 | IC4.27 26.74,37.53 25.4,36.2 v25.4,34.29
  Bottom 0.406: v26.67,13.97 26.67,19.05 25.4,20.32 v25.4,34.29
LED2  (via drill 0.6)
  Top 0.406: v26.67,21.59 26.67,16.51 27.94,15.24 33.02,15.24 34.29,13.97 51.28,13.97 R15.1 | IC4.28 27.54,35.16 v26.67,34.29
  Bottom 0.406: v26.67,21.59 v26.67,34.29
LOAD+
  Top 0.406: R12.2 81.43,64.92 85.09,68.58 Q1.2 | VLOAD.TP 93.34,48.9 93.98,48.26
  Top 1.676: 90.17,69.85 90.17,74.93 88.9,76.2 86.36,76.2 85.09,77.47 85.09,83.82 83.82,85.09 U$3.POS | 90.17,69.85 88.9,68.58 Q1.2 | Q3.2 88.9,29.21 90.17,30.48 90.17,34.29 93.98,38.1 93.98,48.26 93.98,60.96 90.17,64.77 90.17,69.85
MISO  (via drill 0.6)
  Top 0.406: U$5.MISO 8.89,53.34 20.32,53.34 v22.23,51.44 25.14,48.52 IC4.16 | IC3.14 v58.42,21.59
  Bottom 0.406: v58.42,21.59 57.78,20.95 29.21,20.95 27.94,22.23 27.94,38.1 25.4,40.64 25.4,45.09 22.23,48.26 v22.23,51.44
MOSI  (via drill 0.6)
  Top 0.406: IC6.4 41.27,55.88 40.64,56.52 36.2,56.52 34.29,54.61 26.67,54.61 25.3,53.24 v25.3,50.16 25.94,49.53 IC4.15 | v56.52,22.86 57.15,23.5 IC3.13 | U$5.MOSI 19.68,52.07 v23.5,48.26
  Bottom 0.406: 26.67,48.26 26.67,40.64 29.21,38.1 29.21,22.86 30.48,21.59 55.24,21.59 v56.52,22.86 | 26.67,48.26 v23.5,48.26 | 25.94,49.44 25.94,49.53 | 25.94,49.53 v25.3,50.16 | 26.67,48.26 26.67,48.8 25.94,49.53
N$1
  Top 0.406: 47.62,59.05 IC7.8 R1.3 | 47.62,59.05 IC7.1 | R2.1 47.12,58.55 47.62,59.05
N$2  (via drill 0.6)
  Top 0.406: R1.2 45.09,63.5 43.81,62.23 40.64,62.23 40.01,61.59 IC6.6 | v45.09,71.75 VREF.TP
  Bottom 0.406: R1.2 v45.09,71.75
N$3
  Top 0.406: C4.1 R4.2
N$4
  Top 0.406: U4.1 56.15,40.86 T1.E 52.87,40.96 R22.1
N$5
  Top 0.813: U4.3 FAN1_CONN.1 66.5,38.1
  Top 0.838: 66.5,38.1 D1.A
N$6
  Top 0.406: R3.2 85.09,72.39 86.36,71.12 Q1.1
N$7  (via drill 0.6)
  Top 0.406: v17.78,27.94 16.14,27.94 IC5.9
  Bottom 0.406: JP5.2 19.05,29.21 v17.78,27.94
N$8
  Top 0.406: T1.B 55.73,42.55 51.44,42.55 49.68,40.79 R6.2
N$9
  Top 0.406: IC4.7 33.12,45.18 33.66,45.72 38.73,45.72 40.01,44.45 40.01,40.64 41.27,39.37 41.66,39.37 Q2.1 | Q2.1 42.16,38.1 42.16,39.62 | 41.91,39.37 Q2.1 | C7.1 42.14,40.87 42.16,39.62 | 42.16,39.62 Q2.1
N$10
  Top 0.406: 64.9,55.88 C4.2 | C4.2 64.64,55.88 63.5,55.88 61.59,57.78 59.69,57.78 59.05,58.42 IC2.7 59.05,64.77 60.96,66.67 71.75,66.67 77.47,72.39 R3.1 | R16.1 82.4,35.86 81.76,35.71 78.74,38.73 71.75,38.73 69.85,40.64 69.85,52.07 68.58,53.34 66.04,53.34 64.77,54.61 | 64.77,55.88 C4.2 | 64.77,54.61 C4.2 | FET_DRV.TP 64.77,54.61
N$11
  Top 0.406: IC4.8 33.02,46.77 33.02,47.62 34.29,48.9 41.91,48.9 Q2.2 42.16,48.26 42.16,48.01 44.45,45.72 46.76,45.72 C6.1
N$12
  Top 0.406: 24.77,14.61 24.77,14.12 26.18,12.7 31.75,12.7 33.02,11.43 33.02,8.89 31.6,7.47 JP2.6 29.21,7.13 29.21,6.35 27.94,5.08 24.13,5.08 22.63,6.58 JP2.4 | IC5.8 16.25,22.23 23.5,22.23 24.77,20.95 24.77,14.61 | DTR_IN.TP 24.77,14.61
N$13  (via drill 0.6)
  Top 0.406: v9.53,26.67 IC5.14 | v20.95,13.97 RX_IN.TP
  Bottom 0.406: v9.53,26.67 10.79,25.4 13.97,25.4 15.24,24.13 15.24,13.97 17.78,11.43 | JP2.2 28.17,6.58 26.67,5.08 19.05,5.08 17.78,6.35 17.78,11.43 | v20.95,13.97 20.32,13.97 17.78,11.43
N$14  (via drill 0.6)
  Top 0.406: JP2.3 23.01,12.7 17.78,12.7 16.51,13.97 v16.51,15.24 TX_IN.TP | v11.43,26.67 10.79,27.3 IC5.13
  Bottom 0.406: v16.51,15.24 16.51,25.4 15.24,26.67 v11.43,26.67
N$15
  Top 0.406: IC5.3 9.53,19.79 C9.- 12.7,17.78
N$16  (via drill 0.6)
  Top 0.406: C9.+ 15.13,14.5 v13.97,13.34 | v6.35,24.13 6.35,23.23 IC5.1
  Bottom 0.406: v13.97,13.34 13.97,22.86 12.7,24.13 v6.35,24.13
N$17
  Top 0.406: C8.- 22.12,19.79 20.32,21.59 17.14,21.59 16.51,20.95 12.7,20.95 12.06,21.59 IC5.5
N$18
  Top 0.406: C8.+ 18.52,19.58 17.78,19.68 11.43,19.68 10.79,20.32 IC5.4
N$19
  Top 0.406: IC5.2 8.26,18.41 8.89,17.78 C11.+
N$20
  Top 0.406: LED4.A 24.52,72.15 R10.2
N$21
  Top 0.406: C10.- 5.82,25.93 6.35,25.4 8.89,25.4 10.16,24.13 12.7,24.13 13.34,23.5 IC5.6
N$22
  Top 0.406: R8.2 LED6.A
N$23
  Top 0.406: R9.2 LED5.A
N$24
  Top 0.406: U$6.VO 33.02,17.14 34.92,15.24 68.58,15.24 69.85,16.51 69.85,28.57 R11.S
N$25
  Top 0.406: U$6.VOUT 71.12,22.23 R11.A
N$26
  Top 0.813: JP1.PWR 21.95,84.09 23.5,82.55 PWR_SWITCH.2
N$27
  Top 0.406: IC3.1 41.91,20.32 43.18,19.05 U$6.DB0
N$28
  Top 0.406: U$6.DB1 45.72,19.05 43.18,21.59 IC3.2
N$29
  Top 0.406: IC3.3 44.45,22.86 48.26,19.05 U$6.DB2
N$30
  Top 0.406: IC3.4 45.72,22.86 U$6.DB3
N$31
  Top 0.406: IC3.5 46.99,22.86 50.16,19.68 52.7,19.68 53.34,19.05 U$6.DB4
N$32
  Top 0.406: IC3.6 48.26,22.86 50.8,20.32 54.61,20.32 55.88,19.05 U$6.DB5
N$33
  Top 0.406: IC3.7 49.53,22.86 51.44,20.95 55.24,20.95 U$6.DB6
N$34
  Top 0.406: IC3.8 50.8,22.86 52.07,21.59 55.88,21.59 57.78,19.68 60.33,19.68 60.96,19.05 U$6.DB7
N$35
  Top 0.406: U$6.CS2 66.04,19.05 62.23,22.86 62.23,26.67 60.96,27.94 57.15,27.94 55.88,29.21 51.44,29.21 50.8,29.84 IC3.21
N$36
  Top 0.406: IC3.22 49.53,29.21 50.16,28.57 55.24,28.57 56.52,27.3 59.69,27.3 60.96,26.04 60.96,21.59 63.5,19.05 U$6.CS1
N$37
  Top 0.406: IC3.23 48.26,27.94 46.99,26.67 41.91,26.67 40.64,25.4 U$6.E
N$38
  Top 0.406: IC3.24 46.99,29.21 45.72,27.94 40.64,27.94 39.37,26.67 39.37,20.32 38.1,19.05 U$6.RW
N$39
  Top 0.406: IC3.25 45.72,30.48 44.45,29.21 39.37,29.21 38.1,27.94 38.1,21.59 35.56,19.05 U$6.DI
N$40
  Top 0.406: IC4.20 20.15,43.58 C18.1
N$41
  Top 0.813: D2.A 19.68,77.47 PWR_SWITCH.1
N$42
  Top 0.406: U9.1 56.15,48.48 T2.E 52.87,48.58 R21.1
N$43
  Top 0.406: R14.2 48.41,9.04 LED1.A
N$44
  Top 0.406: LED2.A 55.88,12.55 R15.2
N$45
  Top 0.406: JP3.4 60.69,87.63 53.34,87.63 49.53,83.82 48.26,83.82 46.99,85.09 46.99,90.17 45.99,91.17 35.05,91.17 S1.SW+
N$46
  Bottom 0.406: JP3.3 63.23,87.63 52.07,87.63 50.53,86.09 49.53,86.09 S1.A
N$47
  Top 0.406: Q3.1 83.03,31.75 R16.2
N$48
  Top 0.406: T2.B 51.75,50.48 49.53,48.26 49.68,48.9 R19.2
N$49
  Bottom 0.406: JP3.2 62.5,88.9 51.54,88.9 S1.B
N$50
  Top 0.813: D3.A 66.5,48.26 FAN2_CONN.1 59.69,45.72 U9.3
N$51
  Top 0.406: LED3.A 63.5,9.53 60.33,12.7 60.96,12.55 R20.2
RST  (via drill 0.6)
  Top 0.406: C17.1 C12.1 18.82,40.23 20.32,38.73 23.5,38.73 25.4,40.64 27.94,40.64 28.34,40.24 IC4.29 28.34,40.41 28.57,40.64 30.48,40.64 33.66,37.47 v34.29,37.47 RST.TP | U$6.RST 68.58,19.05 63.5,24.13 63.5,27.94 62.23,29.21 57.15,29.21 54.61,31.75 IC3.18 v54.61,37.47 | R7.2 15.16,40.16 C17.1 | v11.43,41.91 C17.1
  Bottom 0.406: v34.29,37.47 v54.61,37.47 | U$5.RST 8.89,48.26 10.16,48.26 11.43,46.99 v11.43,41.91
RST_EN
  Top 0.406: JP5.1 21.59,36.83 20.95,37.47 18.64,37.47 C12.2
RX
  Top 0.406: IC4.30 29.14,30.48 28.5,29.84 | IC5.12 12.06,29.84 12.7,30.48 17.14,30.48 19.53,28.09 R9.1 20.17,29.06 20.95,29.84 28.5,29.84 | 28.5,29.84 28.5,28.64 RX.TP
SCK  (via drill 0.6)
  Top 0.406: U$5.SCK 8.89,50.8 19.05,50.8 23.65,46.2 IC4.17 30.74,45.98 v31.75,46.99 31.75,47.62 34.29,50.16 38.1,50.16 40.01,52.07 IC6.3 | IC3.12 v55.88,26.04
  Bottom 0.406: v55.88,26.04 52.7,22.86 33.02,22.86 31.75,24.13 v31.75,46.99
TH1  (via drill 0.6)
  Top 0.406: IC8.2 93.98,29.21 95.25,27.94 95.25,22.86 v93.98,21.59 | R18.2 v78.74,21.59 | IC4.23 20.86,41.18 v20.32,40.64
  Bottom 0.406: v93.98,21.59 v78.74,21.59 78.74,16.51 77.47,15.24 30.48,15.24 27.94,12.7 25.4,12.7 24.13,13.97 24.13,34.29 20.32,38.1 v20.32,40.64
TH2  (via drill 0.6)
  Top 0.406: IC4.24 21.85,40.38 v21.59,40.01 | R17.2 81.28,76.7 81.28,74.93 80.64,74.3 v79.38,74.3
  Bottom 0.406: v21.59,40.01 21.59,44.45 18.41,47.62 18.41,59.69 20.95,62.23 56.52,62.23 57.78,63.5 57.78,68.58 59.05,69.85 74.93,69.85 v79.38,74.3 80.01,74.93 88.9,74.93 90.17,73.66 90.17,69.85 91.44,68.58 IC9.2
TX
  Top 0.406: IC5.11 13.34,25.4 13.97,24.77 R8.1 20.17,23.96 20.95,23.18 28.26,23.18 TX.TP 30.48,25.4 30.48,36.83 29.94,37.37 IC4.31
VCC  (via drill 0.6)
  Top 0.406: 13.97,73.89 C2.1 | 3.81,17.78 C11.- 5.08,18.31 v5.08,21.59 5.08,22.63 C13.2 | v6.99,26.67 IC5.16 6.99,31.11 7.62,31.75 15.88,31.75 16.51,32.38 v16.51,35.56 15.24,36.83 15.24,36.86 15.28,36.9 | v35.56,53.34 36.27,53.34 IC6.1 | 35.56,44.38 IC4.6 31.18,44.38 30.39,45.18 IC4.18 22.13,45.18 20.32,46.99 C16.1 19.91,48.03 19.05,48.9 v16.51,48.9 | 35.56,44.38 v37.53,44.38 | C14.1 35.56,44.38 | 15.39,36.83 15.28,36.9 | 15.28,36.9 R7.1 | 78.74,76.2 78.74,76.7 R17.1 | +5V.TP 28.57,71.12 27.3,69.85 27.3,65.41 | IC4.4 34.69,42.78 35.56,41.91 35.33,41.91 C15.1 37.23,42.14 37.47,41.91 | R20.1 72.39,12.06 73.66,13.34 U$6.BLA
  Top 0.813: U$6.VDD 30.48,20.32 v34.29,24.13 34.29,32.38 37.47,35.56 37.47,41.91 37.47,44.31 v37.53,44.38 | 35.56,65.41 v35.56,57.78 | C2.1 IC1.3 | 35.56,65.41 27.3,65.41 24.13,65.41 23.5,66.04 23.5,67.94 20.32,71.12 | 78.74,76.2 v76.83,74.3 | v76.83,74.3 72.39,69.85 36.83,69.85 35.56,68.58 35.56,65.41 | R10.1 20.17,71.27 20.32,71.12 | IC3.9 v52.07,26.04 | R18.1 78.61,26.67 76.2,26.67 74.93,25.4 74.93,22.86 73.66,21.59 U$6.BLA | 13.97,73.89 13.97,72.39 15.24,71.12 20.32,71.12 | U$10.OUT+ 73.03,79.38 76.83,75.56 v76.83,74.3
  Bottom 0.406: v6.99,26.67 5.08,25.4 v5.08,21.59 | v16.51,35.56 v16.51,48.9 16.51,53.34 15.24,54.61 U$5.+5V
  Bottom 0.813: v35.56,57.78 v35.56,53.34 37.53,51.37 v37.53,44.38 | v34.29,24.13 50.4,24.13 52.07,25.8 v52.07,26.04 53.34,27.3 56.52,27.3 63.5,20.32 72.39,20.32 73.66,19.05 U$6.BLA 73.66,21.59 74.93,22.86 91.44,22.86 93.34,24.77 IC8.3 | IC9.3 93.98,66.04 95.25,67.31 95.25,74.93 93.98,76.2 78.74,76.2 v76.83,74.3
VLOAD_ATT  (via drill 0.6)
  Top 0.406: IC4.26 25.94,38.01 v24.13,36.2 | v76.2,68.58 R13.2 R12.1 | v59.05,66.67 v56.52,66.67 | v56.52,71.75 VLOAD_ATT.TP
  Bottom 0.406: v24.13,36.2 23.5,36.2 22.86,36.83 22.86,44.45 19.68,47.62 19.68,58.42 22.23,60.96 57.78,60.96 59.05,62.23 v59.05,66.67 60.96,68.58 v76.2,68.58 | v56.52,66.67 v56.52,71.75
VLOAD_DROP  (via drill 0.6)
  Top 0.406: IC2.6 60.33,64.14 60.96,64.77 64.14,64.77 | 64.14,64.77 73.66,64.77 74.3,64.14 R5.2 | 64.14,64.77 64.29,64.92 R4.1 | v24.13,37.47 24.77,38.1 24.77,38.51 IC4.25 | VLOAD_DROP.TP v80.01,48.9
  Bottom 0.406: v24.13,37.47 24.13,44.45 20.95,47.62 20.95,57.15 23.5,59.69 58.99,59.69 60.33,61.02 60.33,64.14 60.96,64.77 74.3,64.77 R5.2
  Bottom 1.676: Q3.3 83.82,26.67 80.01,30.48 80.01,48.26 | 80.01,48.26 v80.01,48.9 80.01,62.23 83.82,66.04 Q1.3 | R5.2 74.93,53.34 80.01,48.26
VLOAD_REF  (via drill 0.6)
  Top 0.406: IC2.3 v60.33,52.07 | v37.47,57.78 IC6.8 v37.47,67.94 | v50.8,71.75 VLOAD_REF.TP
  Bottom 0.406: v60.33,52.07 39.37,52.07 37.47,53.98 v37.47,57.78 | v37.47,67.94 37.47,73.03 38.1,73.66 50.16,73.66 50.8,73.03 v50.8,71.75
VREF_BUF  (via drill 0.6)
  Top 0.406: IC2.2 IC2.1 57.73,54.61 56.52,53.4 v56.52,53.34 | IC2.5 v61.59,61.59
  Bottom 0.406: v61.59,61.59 61.59,53.98 60.96,53.34 v56.52,53.34

### Text on the board
tPlace: LOAD / INPUT
tNames: 12V | ENCODER | + | POWER / SWITCH | ENCODER | 0R1 Shunt Resistor / 5W | FAN 2 | Mega / 328 | Reset / on DTR | FAN 1 | MCP23S17 | MAX232 | RS232 | Load Enable | Heat Shutdown | Power
bNames: 12V IN | Smart Dummy Load | by nupo-artworks.de | 20V | 50W | Maximum Ratings: | 10V | 20V | U IN | 50W | P MAX | 5A | I SET | 5A | 2.5A | github.com/dangrie158/SmartDummyLoad